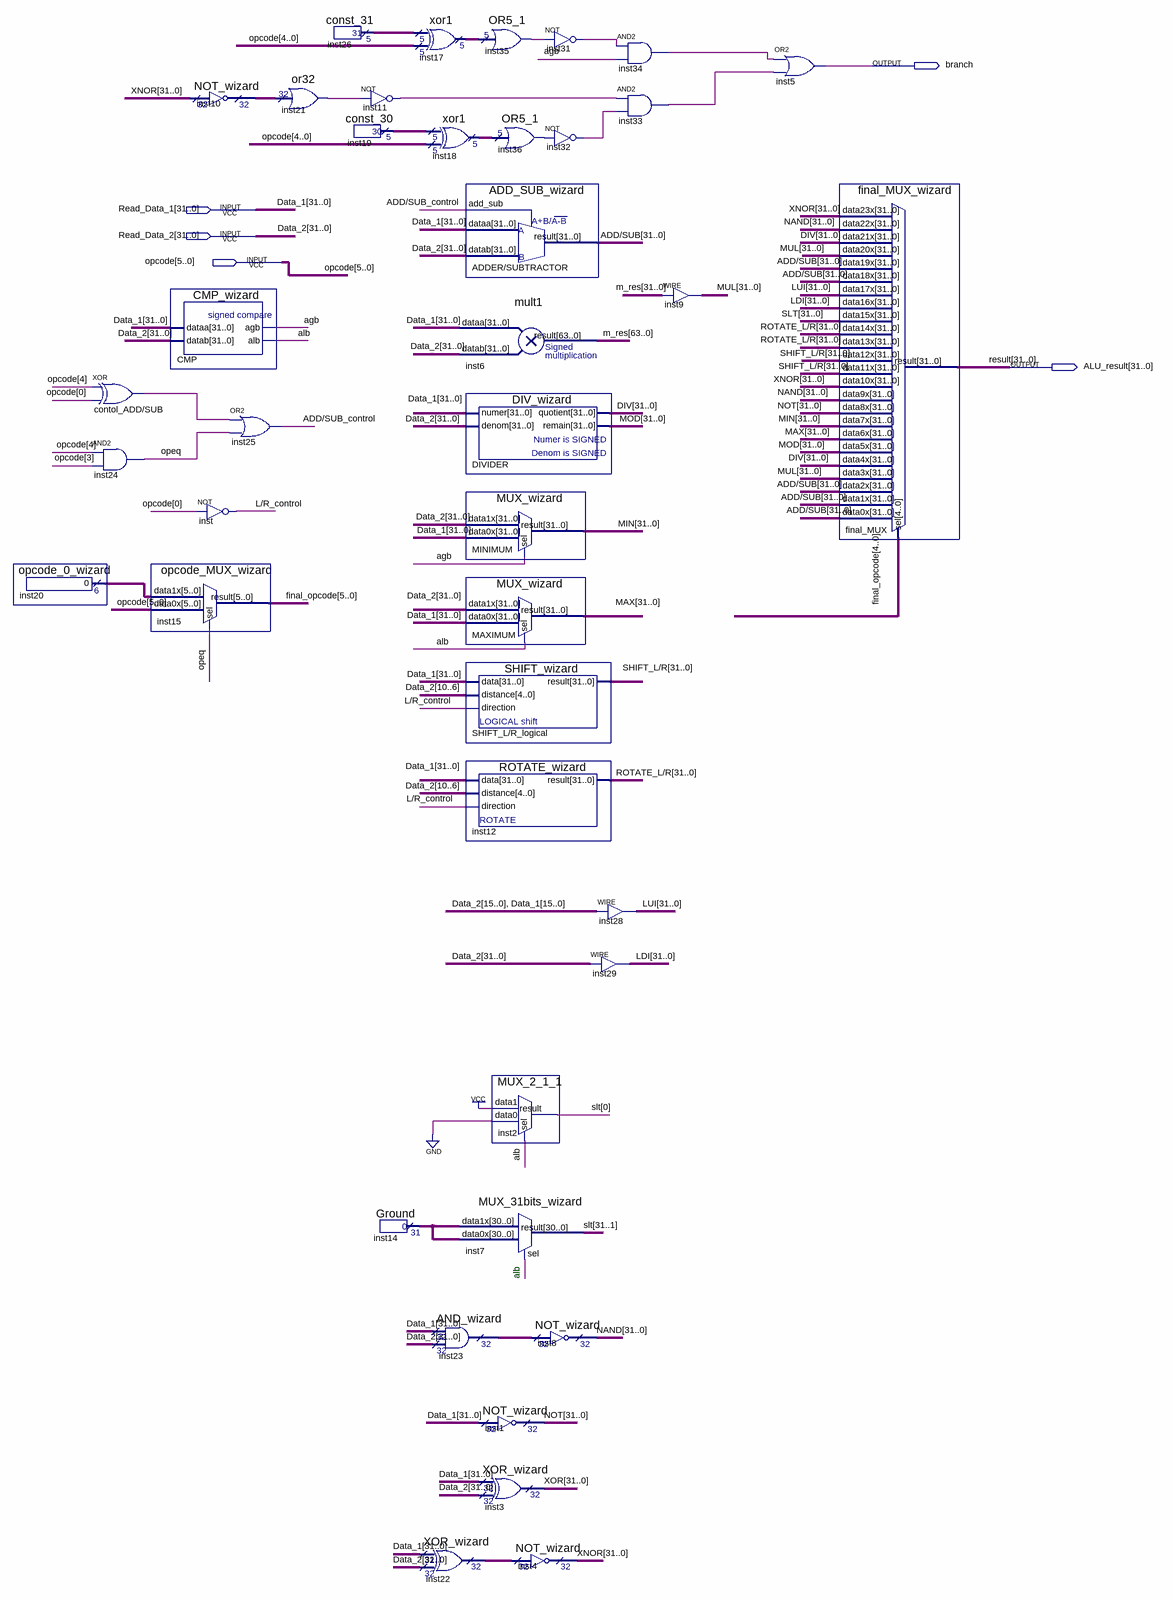
[diagram p0: schematic sheet]
// Quartus schematic ALU.bdf as structural Verilog: 41 symbols, 5 pins
module ALU (
  input  [31:0] Read_Data_1,
  input  [31:0] Read_Data_2,
  input  [5:0] opcode,
  output branch,
  output [31:0] ALU_result
);

  wire \ADD/SUB_control , agb, alb, contol_ADD_SUB_out, inst11_out, inst21_result, inst31_out, inst32_out,
       inst33_out, inst34_out, inst35_result, inst36_result, \L/R_control , opeq;
  wire [4:0] inst17_result, inst18_result, inst19_result, inst26_result;
  wire [5:0] final_opcode, inst20_result;
  wire [30:0] inst14_result;
  wire [31:0] \ADD/SUB , DIV, inst10_result, inst22_result, inst23_result, LDI, LUI, MAX, MIN, MOD, MUL,
       NAND, NOT, \ROTATE_L/R , \SHIFT_L/R , SLT, XNOR, XOR;
  wire [63:0] m_res;

  opcode_0_wizard inst20 (.result(inst20_result));
  xor \contol_ADD/SUB  (contol_ADD_SUB_out, opcode[4], opcode[0]);
  and inst24 (opeq, opcode[4], opcode[3]);
  opcode_MUX_wizard inst15 (.data1x(inst20_result), .data0x(opcode), .sel(opeq), .result(final_opcode));
  NOT_wizard inst10 (.data(XNOR), .result(inst10_result));
  CMP_wizard CMP (.dataa(Read_Data_1), .datab(Read_Data_2), .agb(agb), .alb(alb));
  not inst (\L/R_control , opcode[0]);
  or inst25 (\ADD/SUB_control , contol_ADD_SUB_out, opeq);
  or32 inst21 (.data(inst10_result), .result(inst21_result));
  const_31 inst26 (.result(inst26_result));
  not inst11 (inst11_out, inst21_result);
  const_30 inst19 (.result(inst19_result));
  xor1 inst17 (.data0x(inst26_result), .data1x(opcode[4:0]), .result(inst17_result));
  Ground inst14 (.result(inst14_result));
  xor1 inst18 (.data0x(inst19_result), .data1x(opcode[4:0]), .result(inst18_result));
  ADD_SUB_wizard \ADDER/SUBTRACTOR  (
    .add_sub(\ADD/SUB_control ), .dataa(Read_Data_1), .datab(Read_Data_2), .result(\ADD/SUB ));
  mult1 inst6 (.dataa(Read_Data_1), .datab(Read_Data_2), .result(m_res));
  DIV_wizard DIVIDER (.numer(Read_Data_1), .denom(Read_Data_2), .quotient(DIV), .remain(MOD));
  MUX_wizard MINIMUM (.data1x(Read_Data_2), .data0x(Read_Data_1), .sel(agb), .result(MIN));
  MUX_wizard MAXIMUM (.data1x(Read_Data_2), .data0x(Read_Data_1), .sel(alb), .result(MAX));
  SHIFT_wizard \SHIFT_L/R_logical  (
    .data(Read_Data_1), .distance(Read_Data_2[10:6]), .direction(\L/R_control ), .result(\SHIFT_L/R ));
  ROTATE_wizard inst12 (
    .data(Read_Data_1), .distance(Read_Data_2[10:6]), .direction(\L/R_control ), .result(\ROTATE_L/R ));
  MUX_31bits_wizard inst7 (.data1x(inst14_result), .data0x(inst14_result), .sel(alb), .result(SLT[31:1]));
  AND_wizard inst23 (.data0x(Read_Data_1), .data1x(Read_Data_2), .result(inst23_result));
  XOR_wizard inst22 (.data0x(Read_Data_1), .data1x(Read_Data_2), .result(inst22_result));
  OR5_1 inst35 (.data(inst17_result), .result(inst35_result));
  OR5_1 inst36 (.data(inst18_result), .result(inst36_result));
  MUX_2_1_1 inst2 (.data1(1'b1), .data0(1'b0), .sel(alb), .result(SLT[0]));
  NOT_wizard inst1 (.data(Read_Data_1), .result(NOT));
  XOR_wizard inst3 (.data0x(Read_Data_1), .data1x(Read_Data_2), .result(XOR));
  NOT_wizard inst4 (.data(inst22_result), .result(XNOR));
  not inst31 (inst31_out, inst35_result);
  not inst32 (inst32_out, inst36_result);
  NOT_wizard inst8 (.data(inst23_result), .result(NAND));
  and inst34 (inst34_out, inst31_out, agb);
  and inst33 (inst33_out, inst11_out, inst32_out);
  assign LUI = {Read_Data_2[15:0], Read_Data_1[15:0]};  // WIRE inst28
  assign LDI = Read_Data_2;  // WIRE inst29
  assign MUL = m_res[31:0];  // WIRE inst9
  or inst5 (branch, inst34_out, inst33_out);
  final_MUX_wizard final_MUX (
    .data23x(XNOR), .data22x(NAND), .data21x(DIV), .data20x(MUL), .data19x(\ADD/SUB ), .data18x(\ADD/SUB ),
    .data17x(LUI), .data16x(LDI), .data15x(SLT), .data14x(\ROTATE_L/R ), .data13x(\ROTATE_L/R ),
    .data12x(\SHIFT_L/R ), .data11x(\SHIFT_L/R ), .data10x(XNOR), .data9x(NAND), .data8x(NOT), .data7x(MIN),
    .data6x(MAX), .data5x(MOD), .data4x(DIV), .data3x(MUL), .data2x(\ADD/SUB ), .data1x(\ADD/SUB ),
    .data0x(\ADD/SUB ), .sel(final_opcode[4:0]), .result(ALU_result));

  // Other names for the same wires on the sheet: Data_1[31:0] = Read_Data_1; Data_2[31:0] = Read_Data_2;
  //   result[31:0] = ALU_result

  // Notes on the sheet:
  //   alb
endmodule
